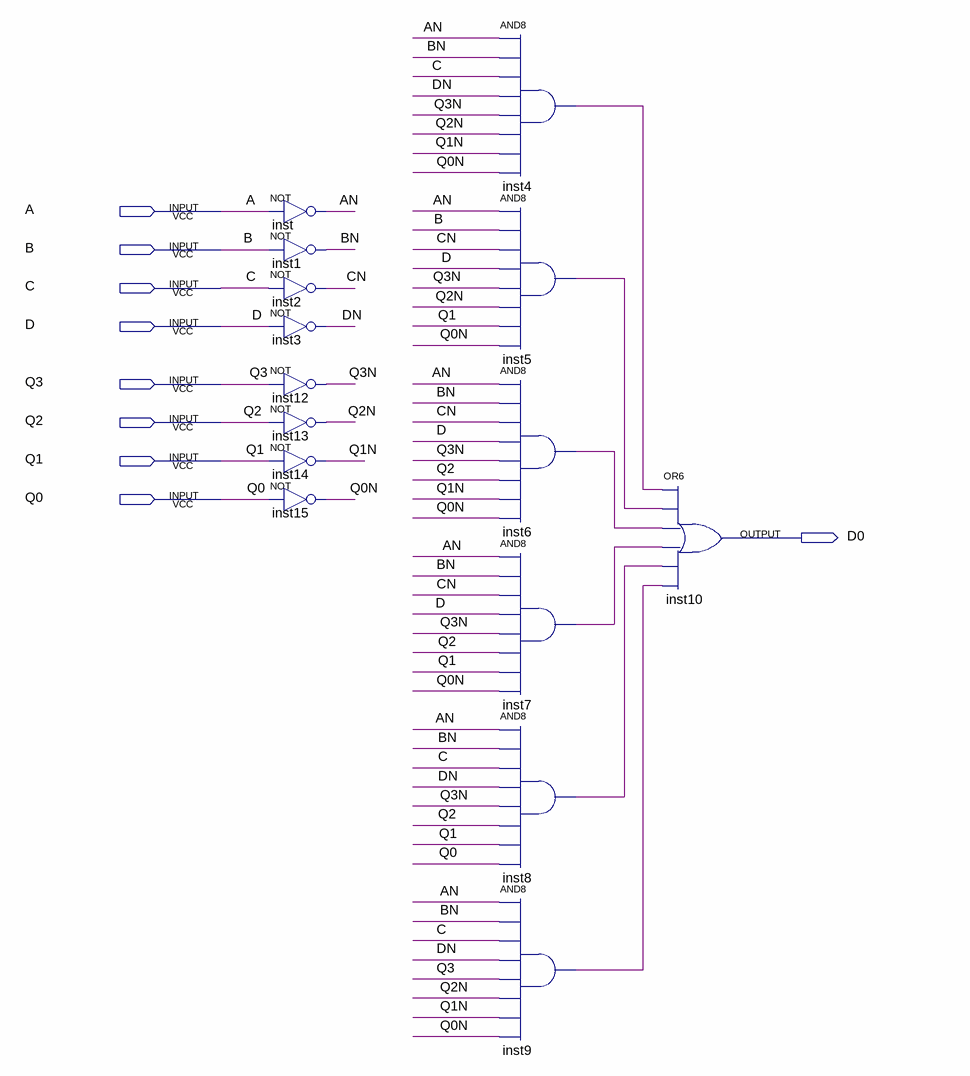
[diagram p0: schematic sheet]
// Quartus schematic D0.bdf as structural Verilog: 15 symbols, 9 pins
module D0 (
  input  A,
  input  B,
  input  C,
  input  D,
  input  Q3,
  input  Q2,
  input  Q1,
  input  Q0,
  output D0
);

  wire AN, BN, CN, DN, inst4_out, inst5_out, inst6_out, inst7_out, inst8_out, inst9_out, Q0N, Q1N, Q2N, Q3N;

  not inst (AN, A);
  not inst1 (BN, B);
  not inst2 (CN, C);
  not inst3 (DN, D);
  not inst12 (Q3N, Q3);
  not inst13 (Q2N, Q2);
  not inst14 (Q1N, Q1);
  not inst15 (Q0N, Q0);
  and inst4 (inst4_out, AN, BN, C, DN, Q3N, Q2N, Q1N, Q0N);
  and inst5 (inst5_out, AN, B, CN, D, Q3N, Q2N, Q1, Q0N);
  and inst6 (inst6_out, AN, BN, CN, D, Q3N, Q2, Q1N, Q0N);
  and inst7 (inst7_out, AN, BN, CN, D, Q3N, Q2, Q1, Q0N);
  and inst8 (inst8_out, AN, BN, C, DN, Q3N, Q2, Q1, Q0);
  and inst9 (inst9_out, AN, BN, C, DN, Q3, Q2N, Q1N, Q0N);
  or inst10 (D0, inst4_out, inst5_out, inst6_out, inst7_out, inst8_out, inst9_out);
endmodule
